# EAGLE schematic 20240102-fresh_air_control (EAGLE 9.6.2)

## Sheet 1 of 2
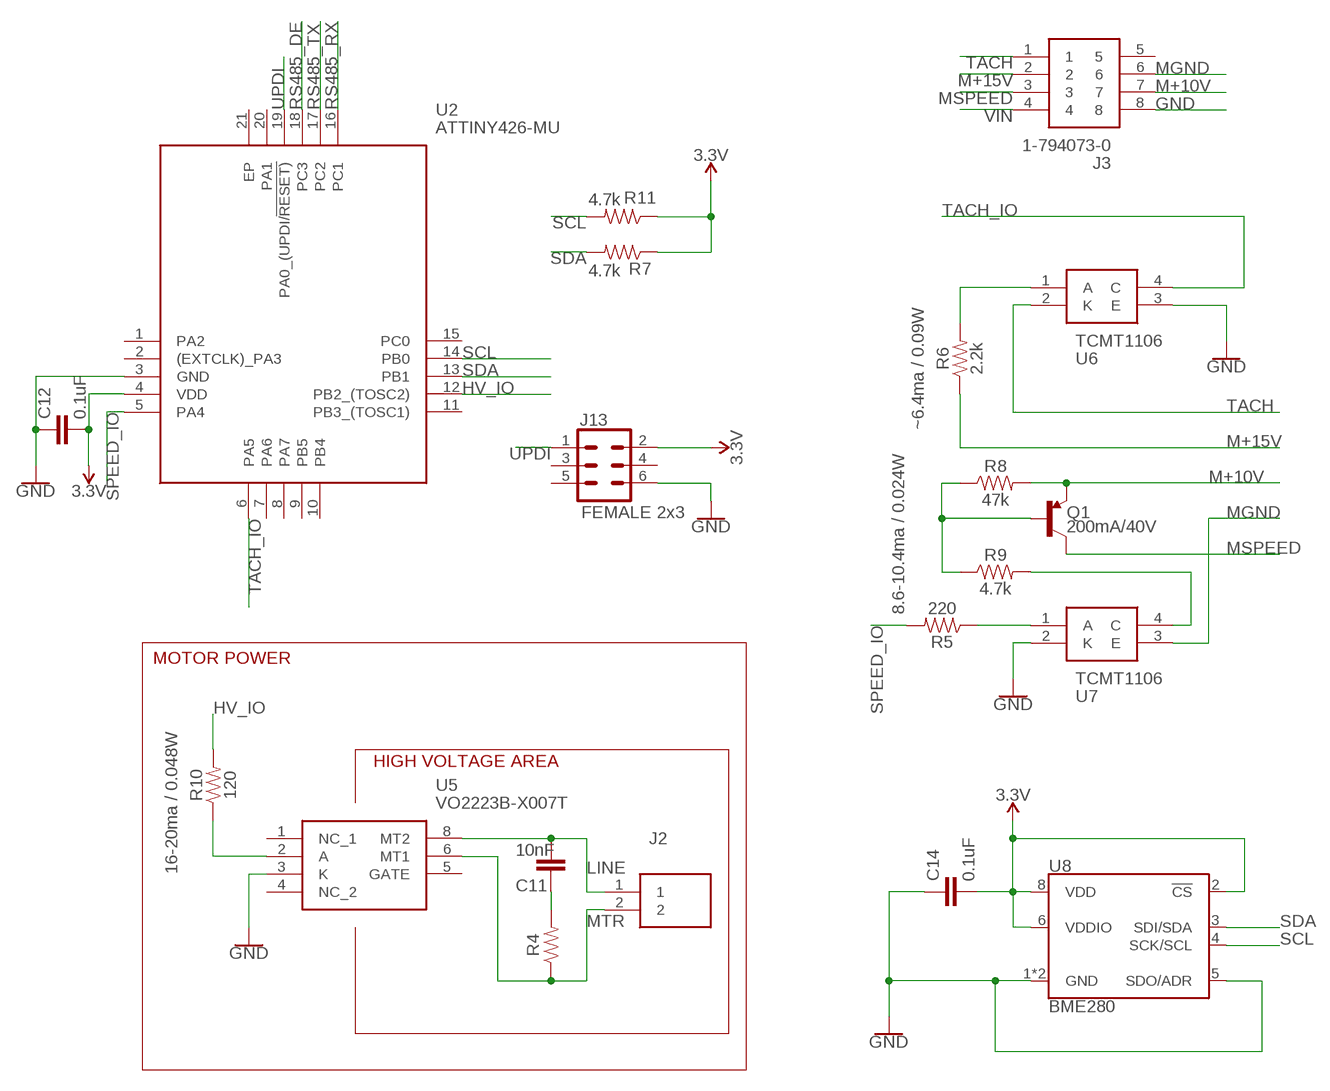
[diagram p0: schematic, sheet 1]

### Parts
C11  10nF  10NF-0805-400V-20%  [0805]
C12  0.1uF  0.1UF-0603-25V-5%  [0603]
C14  0.1uF  0.1UF-0603-25V-5%  [0603]
J2  1-770166-0  [17701660]
J3  1-794073-0  [17940730]
J13  FEMALE 2x3  CONN_03X2FEMALE  [2X3]
Q1  200mA/40V  TRANS_PNP-PMBT3906|MMBT3906L  [SOT23-3]
R4  100  100OHM-0805-1/10W-5%-400V  [0805]
R5  220  220OHM-0603-1/10W-1%  [0603]
R6  2.2k  2.2KOHM-0603-1/10W-1%  [0603]
R7  4.7k  4.7KOHM-0603-1/10W-1%  [0603]
R8  47k  47KOHM-0603-1/10W-1%  [0603]
R9  4.7k  4.7KOHM-0603-1/10W-1%  [0603]
R10  120  120OHM-0603-1/10W-5%  [0603]
R11  4.7k  4.7KOHM-0603-1/10W-1%  [0603]
U2  ATTINY426-MU  [QFN40P300X300X90-21N]
U5  VO2223B-X007T  [VO2223BX007T]
U6  TCMT1106  [SOIC127P700X230-4N]
U7  TCMT1106  [SOIC127P700X230-4N]
U8  BME280  [LGA-8-2.5X2.5]

### Nets
3.3V: C12.2 C14.2 J13.2 R7.1 R11.1 U2.4(VDD) U8.2(!CS) U8.6(VDDIO) U8.8(VDD) ; also sheet 2
GND: C12.1 C14.1 J3.8 J13.6 U2.3(GND) U5.3(K) U6.3(E) U7.2(K) U8.1(GND) U8.5(SDO/ADR) U8.7(GND) ; also sheet 2
HV_IO: R10.2 U2.12(PB2_(TOSC2)) ; also sheet 2
HV_SW: R10.1 U5.2(A)
LINE: C11.1 J2.1 U5.8(MT2)
M+10V: J3.7 Q1.2(E) R8.2
M+15V: J3.2 R6.1
MGND: J3.6 U7.3(E)
MSPEED: J3.3 Q1.3(C)
MTR: J2.2 R4.1 U5.6(MT1)
N$10: R6.2 U6.1(A)
N$11: C11.2 R4.2
N$13: R5.1 U7.1(A)
N$15: Q1.1(B) R8.1 R9.1
N$16: R9.2 U7.4(C)
RS485_DE: U2.18(PC3) ; also sheet 2
RS485_RX: U2.16(PC1) ; also sheet 2
RS485_TX: U2.17(PC2) ; also sheet 2
SCL: R11.2 U2.14(PB0) U8.4(SCK/SCL) ; also sheet 2
SDA: R7.2 U2.13(PB1) U8.3(SDI/SDA) ; also sheet 2
SPEED_IO: R5.2 U2.5(PA4) ; also sheet 2
TACH: J3.1 U6.2(K)
TACH_IO: U2.6(PA5) U6.4(C) ; also sheet 2
UPDI: J13.1 U2.19(PA0_(UPDI/!RESET))
VIN: J3.4 ; also sheet 2
Unconnected: J3.5 J13.3 J13.4 J13.5 U2.1(PA2) U2.2((EXTCLK)_PA3) U2.7(PA6) U2.8(PA7) U2.9(PB5) U2.10(PB4) U2.11(PB3_(TOSC1)) U2.15(PC0) U2.20(PA1) U2.21(EP) U5.1(NC_1) U5.4(NC_2) U5.5(GATE)

### Notes on the sheet
- ~6.4ma / 0.09W
- 8.6-10.4ma / 0.024W
- MOTOR POWER
- HIGH VOLTAGE AREA
- 16-20ma / 0.048W

## Sheet 2 of 2
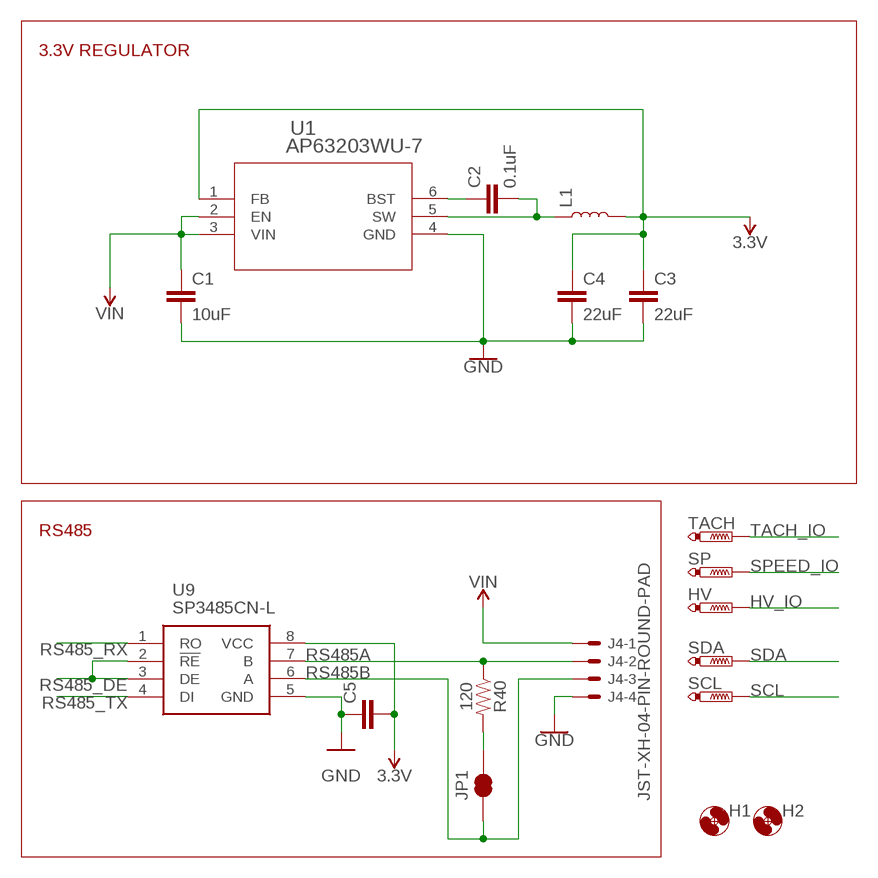
[diagram p1: schematic, sheet 2]

### Parts
C1  10uF  10UF-1206-6.3V-20%  [1206]
C2  0.1uF  0.1UF-0603-25V-5%  [0603]
C3  22uF  22UF-0805-6.3V-20%  [0805]
C4  22uF  22UF-0805-6.3V-20%  [0805]
C5  0.1uF  0.1UF-0603-25V-5%  [0603]
H1  MOUNT-HOLE3.3  [3,3]
H2  MOUNT-HOLE3.3  [3,3]
HV  PTR1B1,27  [B1,27]
J4  JST-XH-04-PIN-ROUND-PAD  [JST-XH-04-PACKAGE-ROUND-PAD]
JP1  JUMPER-SMT_2_NC_TRACE_NO-SILK  [SMT-JUMPER_2_NC_TRACE_NO-SILK]
L1  4.7μH_SHIELDED_INDUCTOR  [1008(2520)]
R40  120  120OHM-0603-1/10W-5%  [0603]
SCL  PTR1B1,27  [B1,27]
SDA  PTR1B1,27  [B1,27]
SP  PTR1B1,27  [B1,27]
TACH  PTR1B1,27  [B1,27]
U1  AP63203WU-7  [SOIC_05WU-7_DIO]
U9  SP3485CN-L  [SOIC127P600X175-8N]

### Nets
3.3V: C3.1 C4.1 C5.2 L1.2 U1.1(FB) U9.8(VCC) ; also sheet 1
GND: C1.2 C3.2 C4.2 C5.1 J4.4 U1.4(GND) U9.5(GND) ; also sheet 1
HV_IO: HV.TP ; also sheet 1
N$1: C2.2 L1.1 U1.5(SW)
N$2: C2.1 U1.6(BST)
N$3: JP1.2 R40.2
RS485_DE: U9.2(!RE) U9.3(DE) ; also sheet 1
RS485_RX: U9.1(RO) ; also sheet 1
RS485_TX: U9.4(DI) ; also sheet 1
RS485A: J4.2 R40.1 U9.7(B)
RS485B: J4.3 JP1.1 U9.6(A)
SCL: SCL.TP ; also sheet 1
SDA: SDA.TP ; also sheet 1
SPEED_IO: SP.TP ; also sheet 1
TACH_IO: TACH.TP ; also sheet 1
VIN: C1.1 J4.1 U1.2(EN) U1.3(VIN) ; also sheet 1

### Notes on the sheet
- 3.3V REGULATOR
- RS485

## Library data of the parts
C1 = SparkFun-Capacitors:10UF: 10.0µF ceramic capacitors A capacitor is a passive two-terminal electrical component used to store electrical energy temporarily in an electric field.; PROD_ID: CAP-10057
C2 C5 C12 C14 = SparkFun-Capacitors:0.1UF: 0.1µF ceramic capacitors A capacitor is a passive two-terminal electrical component used to store electrical energy temporarily in an electric field.; PROD_ID: CAP-08604
C3 C4 = SparkFun-Capacitors:22UF: 22µF ceramic capacitors A capacitor is a passive two-terminal electrical component used to store electrical energy temporarily in an electric field.; PROD_ID: CAP-08402
C11 = Capacitors:10NF
H1 H2 = holes:MOUNT-HOLE: MOUNTING HOLE with drill center marker
HV SCL SDA SP TACH = testpad:PTR1: TEST PIN
J2 = Terminals and sockets:1-770166-0: 2w Vertical pin header Tin TE Connectivity MATE-N-LOK Series, 4.14mm Pitch 2 Way Straight Heavy Duty Power Connector, Solder Termination, 9.5A Source: Datasheet <https://www.te.com/commerce/DocumentDelivery/DDEController?Action=showdoc&DocId=Customer Drawing770166MpdfEnglishENG_CD_770166_M.pdf1-770166-0>; DESCRIPTION: 2w Vertical pin header Tin TE Connectivity MATE-N-LOK Series, 4.14mm Pitch 2 Way Straight Heavy Duty Power Connector, Solder Termination, 9.5A; HEIGHT: 14.25mm; MANUFACTURER_NAME: TE Connectivity; MANUFACTURER_PART_NUMBER: 1-770166-0; MOUSER_PART_NUMBER: 571-1-770166-0; MOUSER_PRICE-STOCK: https://www.mouser.co.uk/ProductDetail/TE-Connectivity-AMP/1-770166-0?qs=m8myXnDJXpW%252BZqFFniy0cw%3D%3D
J3 = Terminals and sockets:1-794073-0: Mate-n-lok,Header,plug,8way pin contact Source: Datasheet <https://www.te.com/commerce/DocumentDelivery/DDEController?Action=showdoc&DocId=Customer Drawing794073DpdfEnglishENG_CD_794073_D.pdf1-794073-0>; DESCRIPTION: Mate-n-lok,Header,plug,8way pin contact; HEIGHT: 13.49mm; MANUFACTURER_NAME: TE Connectivity; MANUFACTURER_PART_NUMBER: 1-794073-0; MOUSER_PART_NUMBER: 571-1-794073-0; MOUSER_PRICE-STOCK: https://www.mouser.co.uk/ProductDetail/TE-Connectivity-AMP/1-794073-0/?qs=d1jXZdVA37Fr5TRKsfZNLg%3D%3D
J4 = Rembrandt Electronics - JST XH Connectors v1-0:JST-XH-04-PIN: JST XH Connector 2 Pin Wire to board connector. Pitch: 2,54 mm, (0.100") Number of pins: 4 Created by Rembrandt Electronics www.rembrandtelectronics.com
J13 = SparkFun-Connectors:CONN_03X2: Multi connection point. Often used as Generic Header-pin footprint for 0.1 inch spaced/style header connections You can populate with any combo of single row headers, but if you'd like an exact match, check these: Header - 2x3 (Male, 0.1") <https://www.sparkfun.com/products/12807> (PRT-12807) Header - 2x3 (Female, 0.1") <https://www.sparkfun.com/products/13010> (PRT-13010) 2x3 Pin Shrouded Header <https://www.sparkfun.com/products/10877> (PRT-10877) On any of the 0.1 inch spaced packages, you can populate with these: Break Away Headers - Straight <https://www.sparkfun.com/products/116> (PRT-00116) Break Away Male Headers - Right Angle <https://www.sparkfun.com/products/553> (PRT-00553) Female Headers <https://www.sparkfun.com/products/115> (PRT-00115) Break Away Headers - Machine Pin <https://www.sparkfun.com/products/117> (PRT-00117) Break Away Female Headers - Swiss Machine Pin <https://www.sparkfun.com/products/743> (PRT-00743) Special note: the shrouded connector mates well with our 3x2 ribbon cables: Ribbon Crimp Connector - 6-pin (2x3, Female) <https://www.sparkfun.com/products/10651> (PRT-10651) Ribbon Cable - 6 wire (15ft) <https://www.sparkfun.com/products/10646> (PRT-10646); PROD_ID: CONN-11566
JP1 = SparkFun-Jumpers:JUMPER-SMT_2_NC_TRACE: Normally closed trace jumper This jumper has a trace between two pads so it's normally closed (NC). Use a razor knife to open the connection. For best results follow the IPC guidelines for cutting traces: Cutout at least 0.063 mm (0.005 in). Remove all loose material to clean up the cut area. Seal the cut with an approved epoxy. Reapply solder to reclose the connection.
L1 = SparkFun-Coils:4.7μH_SHIELDED_INDUCTOR: 4.7uH Inductor 4.7uH 1.4A 50mOhm 1008(2520) Package Shielded; PROD_ID: NDUC-14880
Q1 = SparkFun-DiscreteSemi:TRANS_PNP: PNP transistor Current controlled devices typically used to amplify current or used as a switch. SparkFun Products: SparkFun Serial Enabled 16x2 LCD - Red on Black <https://www.sparkfun.com/products/9068> SparkFun Logomatic <https://www.sparkfun.com/products/12772>; PROD_ID: TRANS-08052
R4 = Resistors:100OHM
R5 = SparkFun-Resistors:220OHM: 220Ω resistor A resistor is a passive two-terminal electrical component that implements electrical resistance as a circuit element. Resistors act to reduce current flow, and, at the same time, act to lower voltage levels within circuits. - Wikipedia; PROD_ID: RES-07861
R6 = SparkFun-Resistors:2.2KOHM: 2.2kΩ resistor A resistor is a passive two-terminal electrical component that implements electrical resistance as a circuit element. Resistors act to reduce current flow, and, at the same time, act to lower voltage levels within circuits. - Wikipedia; PROD_ID: RES-08272
R7 R9 R11 = SparkFun-Resistors:4.7KOHM: 4.7kΩ resistor A resistor is a passive two-terminal electrical component that implements electrical resistance as a circuit element. Resistors act to reduce current flow, and, at the same time, act to lower voltage levels within circuits. - Wikipedia; PROD_ID: RES-07857
R8 = SparkFun-Resistors:47KOHM: 47kΩ resistor A resistor is a passive two-terminal electrical component that implements electrical resistance as a circuit element. Resistors act to reduce current flow, and, at the same time, act to lower voltage levels within circuits. - Wikipedia; PROD_ID: RES-07871
R10 R40 = Resistors:120OHM
U1 = Diodes buck converter:AP63203WU-7; COPYRIGHT: Copyright (C) 2023 Ultra Librarian. All rights reserved.; MANUFACTURER_PART_NUMBER: AP63203WU-7; MFR_NAME: Diodes Inc
U2 = ATTINY426-MU:ATTINY426-MU: 8-bit Microcontrollers - MCU 20MHz, 4KB,VQFN20, Ind 85C, Green Source: Datasheet <https://www.microchip.com/content/dam/mchp/documents/MCU08/ProductDocuments/DataSheets/ATtiny424-426-427-824-826-827-DataSheet-DS40002311A.pdf>; DESCRIPTION: 8-bit Microcontrollers - MCU 20MHz, 4KB,VQFN20, Ind 85C, Green; HEIGHT: 0.9mm; MANUFACTURER_NAME: Microchip; MANUFACTURER_PART_NUMBER: ATTINY426-MU; MOUSER_PART_NUMBER: 579-ATTINY426-MU; MOUSER_PRICE-STOCK: https://www.mouser.co.uk/ProductDetail/Microchip-Technology/ATTINY426-MU?qs=pUKx8fyJudAatJqFKBSQfg%3D%3D
U5 = VO2223B-X007T:VO2223B-X007T: Triac & SCR Output Optocouplers 1A, 600V PhotoTRIAC SMD-8, UL, cUL Source: Datasheet <https://www.vishay.com/docs/83312/vo2223b.pdf>; DESCRIPTION: Triac & SCR Output Optocouplers 1A, 600V PhotoTRIAC SMD-8, UL, cUL; HEIGHT: 4.6mm; MANUFACTURER_NAME: Vishay; MANUFACTURER_PART_NUMBER: VO2223B-X007T; MOUSER_PART_NUMBER: 78-VO2223B-X007T; MOUSER_PRICE-STOCK: https://www.mouser.co.uk/ProductDetail/Vishay-Semiconductors/VO2223B-X007T?qs=r5DSvlrkXmLdAybzHjTr7g%3D%3D
U6 U7 = TCMT1106:TCMT1106: Optocoupler Transistor O/P 1-CH Source: Datasheet <https://www.vishay.com/docs/83510/tcmt1100.pdf>; DESCRIPTION: Optocoupler Transistor O/P 1-CH; HEIGHT: 2.3mm; MANUFACTURER_NAME: Vishay; MANUFACTURER_PART_NUMBER: TCMT1106; MOUSER_PART_NUMBER: 782-TCMT1106; MOUSER_PRICE-STOCK: https://www.mouser.co.uk/ProductDetail/Vishay-Semiconductors/TCMT1106?qs=iFB%2FIts7N%252BA3ecLP71cKjQ%3D%3D
U8 = SparkFun-Sensors:BME280: Bosch BME280 – Combined Humidity and Pressure Sensor The BME280 is as combined digital humidity, pressure and temperature sensor based on proven sensing principles. The sensor module is housed in an extremely compact metal-lid LGA package with a footprint of only 2.5×2.5mm² with a height of 0.93mm. Its small dimensions and its low power consumption allow the implementation in battery driven devices such as handsets, GPS modules or watches. Datasheet <https://cdn.sparkfun.com/assets/learn_tutorials/4/1/9/BST-BME280_DS001-10.pdf> SparkFun Products SparkFun Atmospheric Sensor Breakout - BME280 <https://www.sparkfun.com/products/13676> (SEN-13676); PROD_ID: IC-13090
U9 = MaxLinear RS485 SP3485CN-L:SP3485CN-L: Transceiver RS-485 3.3V 10Mbps SOIC8 EXAR SP3485CN-L, Line Transceiver, RS-422, RS-485, 3.3 V, 8-Pin SOIC Source: Datasheet <https://componentsearchengine.com/Datasheets/1/SP3485CN-L.pdf>; DESCRIPTION: Transceiver RS-485 3.3V 10Mbps SOIC8 EXAR SP3485CN-L, Line Transceiver, RS-422, RS-485, 3.3 V, 8-Pin SOIC; HEIGHT: 1.75mm; MANUFACTURER_NAME: EXAR; MANUFACTURER_PART_NUMBER: SP3485CN-L; MOUSER_PART_NUMBER: 701-SP3485CN-L; MOUSER_PRICE-STOCK: https://www.mouser.com/Search/Refine.aspx?Keyword=701-SP3485CN-L